# EAGLE design HenryBoard (EAGLE 7.2.0)

## Sheet 1 of 2: Supply
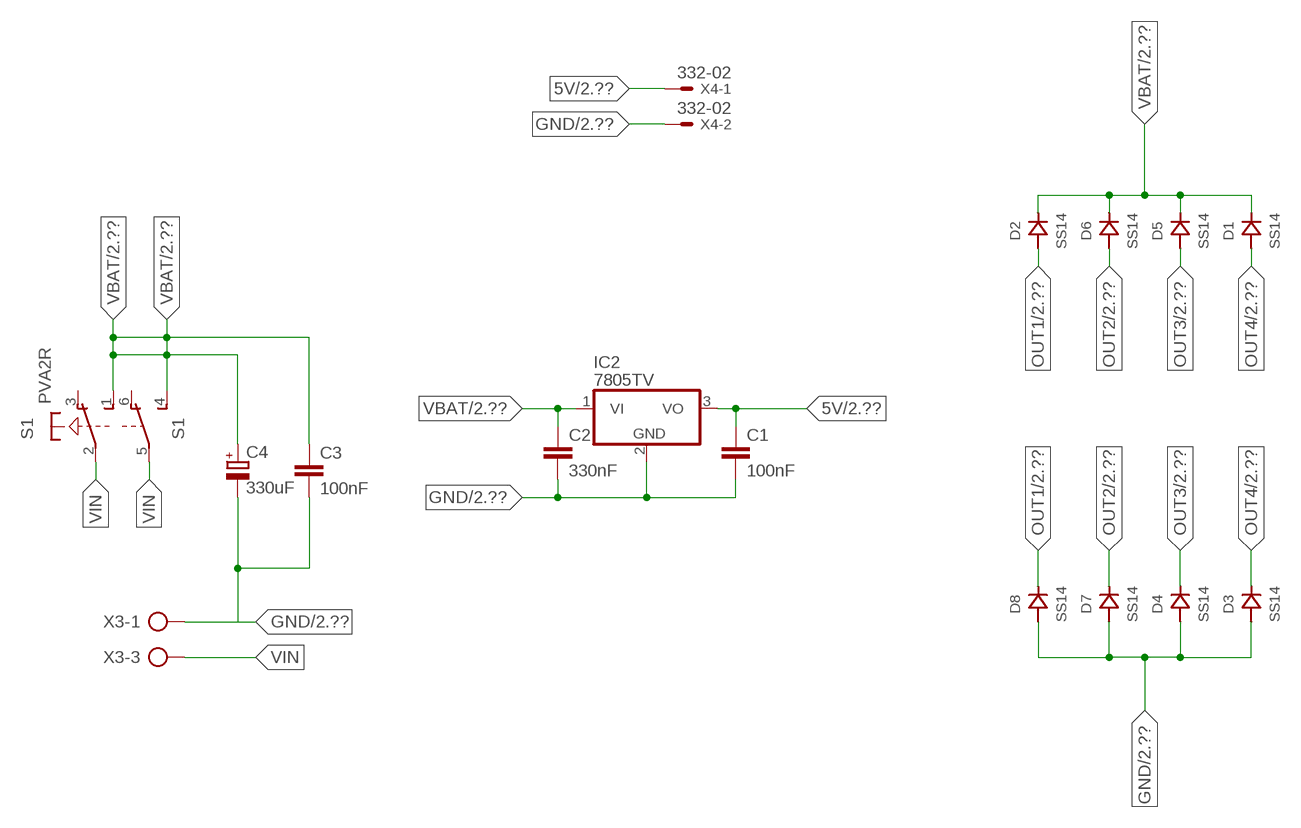
[diagram p0: schematic, sheet 1]

### Parts
C1  100nF  CAP0805  [0805]
C2  330nF  C-EU025-030X050  [C025-030X050]
C3  100nF  CAP0805  [0805]
C4  330uF  CPOL-EUE5-13  [E5-13]
D1  SS14  [DO214]
D2  SS14  [DO214]
D3  SS14  [DO214]
D4  SS14  [DO214]
D5  SS14  [DO214]
D6  SS14  [DO214]
D7  SS14  [DO214]
D8  SS14  [DO214]
IC2  7805TV  [TO220V]
S1  PVA2R  [PVA2R]
X3  AK300/3  [AK300/3]
X4  332-02  [332-02]

### Nets
5V: C1.1 IC2.3(VO) ; also sheet 2
GND: C1.2 C2.2 C3.2 C4.- D3.ANODE D4.ANODE D7.ANODE D8.ANODE IC2.2(GND) X3.1 ; also sheet 2
OUT1: D2.ANODE D8.CATHODE ; also sheet 2
OUT2: D6.ANODE D7.CATHODE ; also sheet 2
OUT3: D4.CATHODE D5.ANODE ; also sheet 2
OUT4: D1.ANODE D3.CATHODE ; also sheet 2
VBAT: C2.1 C3.1 C4.+ D1.CATHODE D2.CATHODE D5.CATHODE D6.CATHODE IC2.1(VI) S1.1(1:S) S1.4(2:S) ; also sheet 2
VIN: S1.2(1:P) S1.5(2:P) X3.3
Unconnected: S1.3(1:O) S1.6(2:O) X3.2 X4.1 X4.2

## Sheet 2 of 2: H Bridge
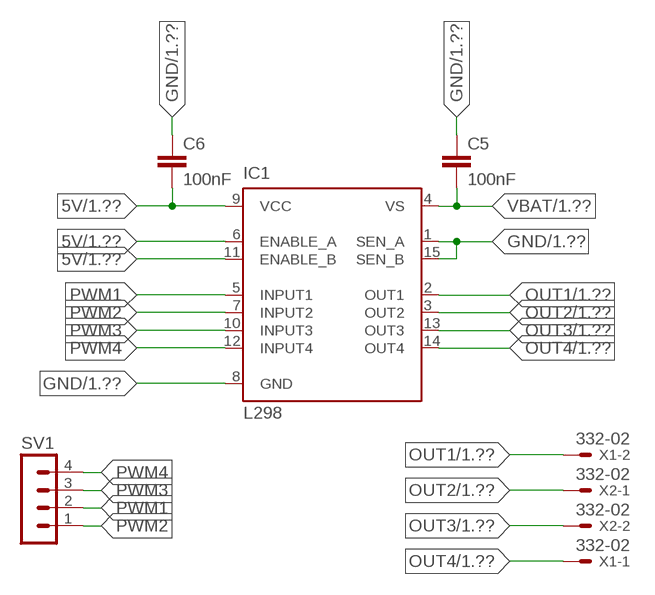
[diagram p1: schematic, sheet 2]

### Parts
C5  100nF  CAP0805  [0805]
C6  100nF  CAP0805  [0805]
IC1  L298  [MULTIWATT-15]
SV1  MA04-1  [MA04-1]
X1  332-02  [332-02]
X2  332-02  [332-02]

### Nets
5V: C6.2 IC1.6(ENABLE_A) IC1.9(VCC) IC1.11(ENABLE_B) ; also sheet 1
GND: C5.1 C6.1 IC1.1(SEN_A) IC1.8(GND) IC1.15(SEN_B) ; also sheet 1
OUT1: IC1.2(OUT1) X1.2 ; also sheet 1
OUT2: IC1.3(OUT2) X2.1 ; also sheet 1
OUT3: IC1.13(OUT3) X2.2 ; also sheet 1
OUT4: IC1.14(OUT4) X1.1 ; also sheet 1
PWM1: IC1.5(INPUT1) SV1.2
PWM2: IC1.7(INPUT2) SV1.1
PWM3: IC1.10(INPUT3) SV1.3
PWM4: IC1.12(INPUT4) SV1.4
VBAT: C5.2 IC1.4(VS) ; also sheet 1

## Library data of the parts
C1 C3 C5 C6 = SparkFun-Capacitors:CAP: Capacitor Standard 0603 ceramic capacitor, and 0.1" leaded capacitor.
C2 = rcl:C-EU: CAPACITOR, European symbol
C4 = rcl:CPOL-EU: POLARIZED CAPACITOR, European symbol
D1-D8 = ihpcb-diode:SS14
IC1 = st-microelectronics:L298: DUAL FULL-BRIDGE DRIVER; MPN: L298N; OC_FARNELL: 1589425; OC_NEWARK: 32M1527
IC2 = linear:78*: Positive VOLTAGE REGULATOR Source: http://cache.national.com/ds/LM/LM78L05.pdf http://www.fairchildsemi.com/ds/LM/LM7805.pdf
S1 = switch-misc:PVA2R: ITT SWITCH
SV1 = con-lstb:MA04-1: PIN HEADER; OC_FARNELL: unknown; OC_NEWARK: unknown
X1 X2 X4 = con-garry:332-02: 2 Pin - 2mm Dual Row Source: www.mpe-connector.de / garry_shortform_2012.pdf
X3 = con-ptr500:AK300/3: CONNECTOR; OC_FARNELL: unknown; OC_NEWARK: unknown

## Board
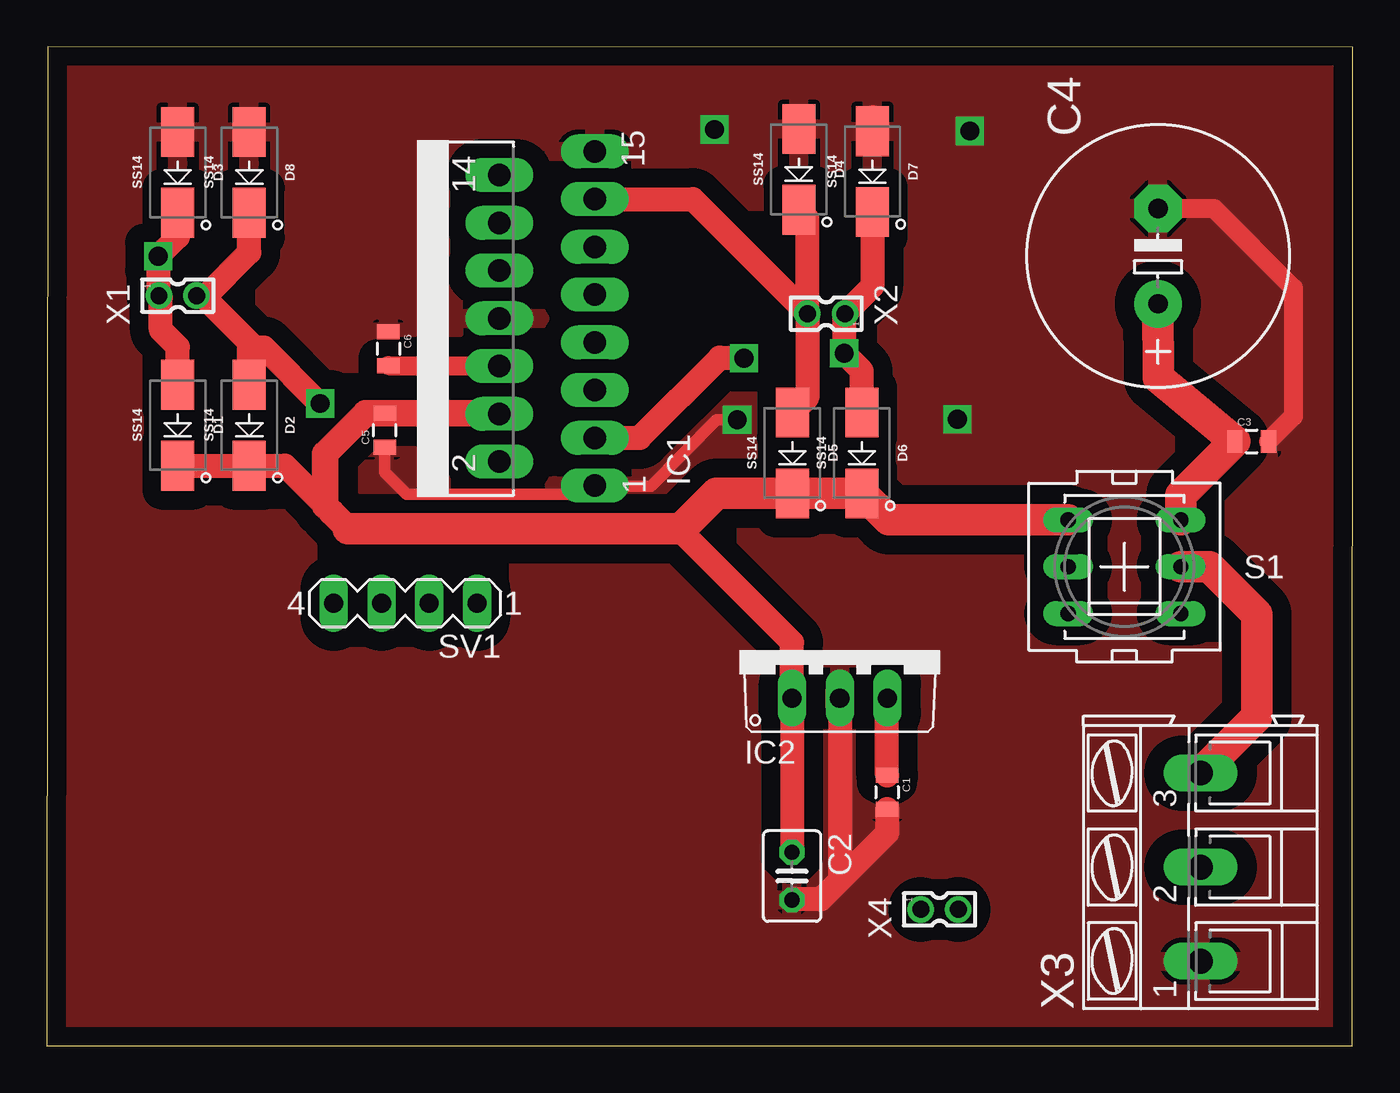
[diagram p2: board, top side]
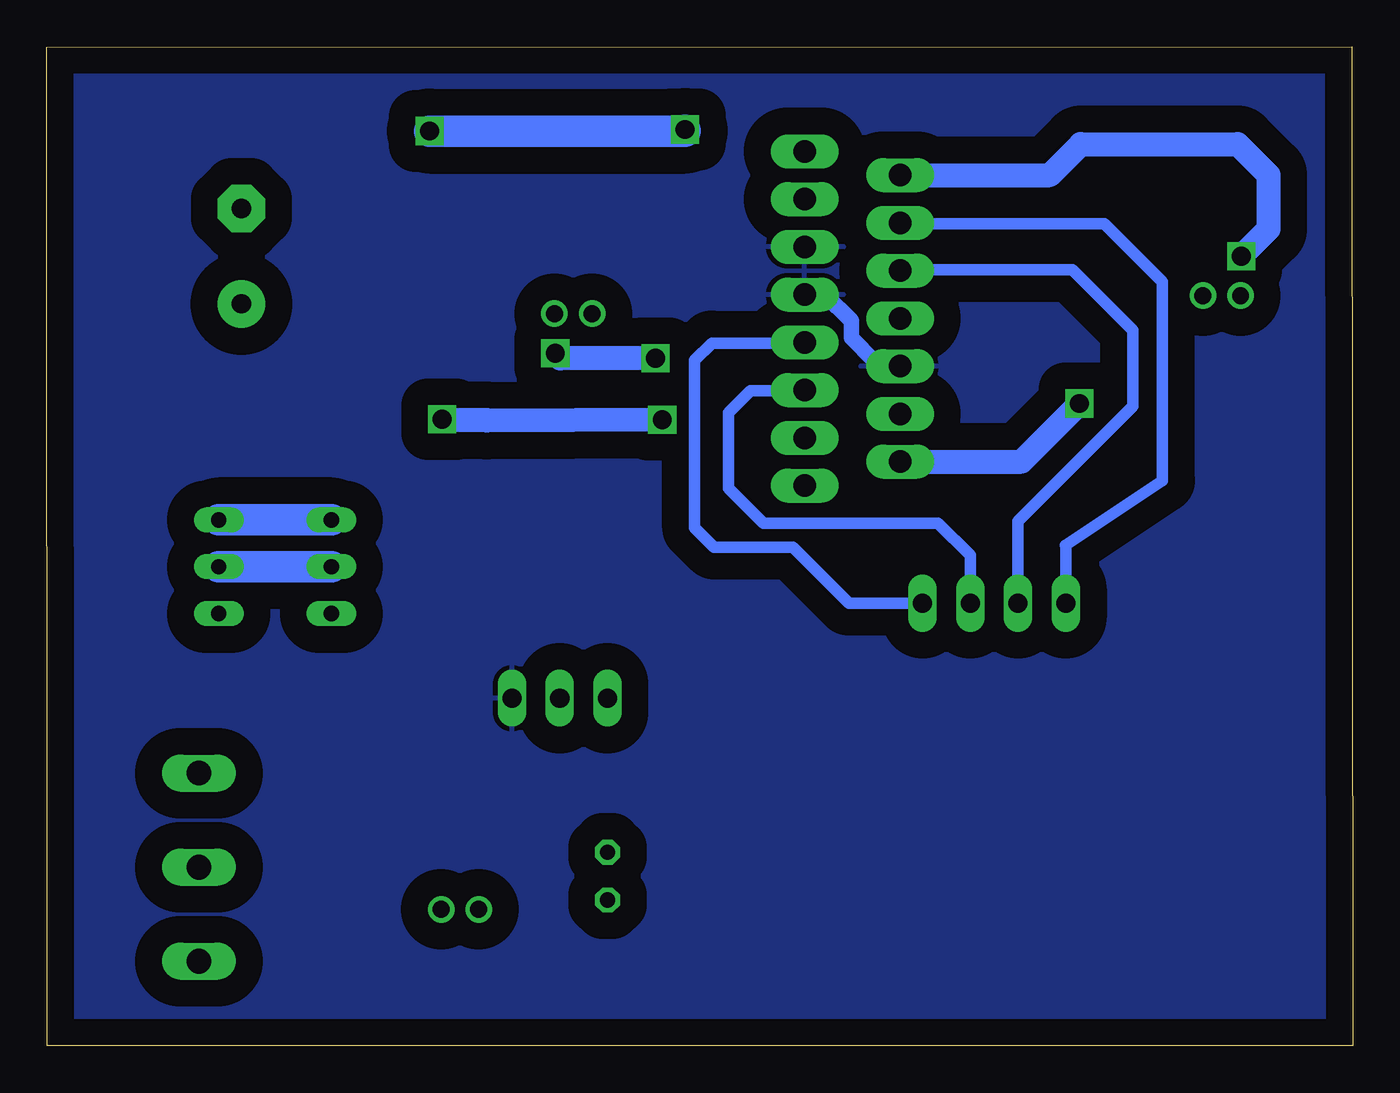
[diagram p3: board, bottom side, seen from below]

Size 69.48 x 53.13 mm. Coordinates in mm from the lower left corner, seen from the top.
Outline: 0,0 69.47,0 69.48,53.11 0.05,53.13 0,0
Copper layers (1*16): Top 0.035mm / dielectric 1.5mm / Bottom 0.035mm
Design rules "default": minimum track width 10mil, minimum drill 24mil, track to track 8mil, track to pad 8mil, pad to pad 8mil, via to via 8mil, smd to smd 8mil, copper to edge 40mil, drill to drill 8mil, minimum pad ring 10mil, minimum via ring 8mil, stop-mask expansion 4mil, vias tented up to drill 0mil, thermal gap 10mil

### Footprints (pad centres in the part's own frame; a part is rotated, then mirrored left to right if it is on the bottom)
0805 = smd 0.8 x 1.2: 1 -0.9,0; 2 0.9,0
C025-030X050 = drill 0.813 octagon: 1 -1.27,0; 2 1.27,0
E5-13 = drill 1.016 pad 2.54: + -2.54,0 | drill 1.016 pad 2.54 octagon: - 2.54,0
DO214 = smd 2.65 x 1.75: ANODE -2.15,0; CATHODE 2.15,0
MULTIWATT-15 = drill 1.2 long: 1 -8.89,-7.62; 2 -7.62,-2.54; 3 -6.35,-7.62; 4 -5.08,-2.54; 5 -3.81,-7.62; 6 -2.54,-2.54; 7 -1.27,-7.62; 8 0,-2.54; 9 1.27,-7.62; 10 2.54,-2.54; 11 3.81,-7.62; 12 5.08,-2.54; 13 6.35,-7.62; 14 7.62,-2.54; 15 8.89,-7.62
TO220V = drill 1.016 long: 1 -2.54,-2.54; 2 0,-2.54; 3 2.54,-2.54
PVA2R = drill 0.813 long: 1 -2.997,2.489; 2 -2.997,0; 3 -2.997,-2.489; 4 2.997,2.489; 5 2.997,0; 6 2.997,-2.489
MA04-1 = drill 1.016 long: 1 -3.81,0; 2 -1.27,0; 3 1.27,0; 4 3.81,0
332-02 = drill 0.9 pad 1.27: 1 0,-1; 2 0,1
AK300/3 = drill 1.321 long: 1 -5.004,0; 2 0,0; 3 5.004,0

### Placement (x,y rotation side)
C1  44.71,13.48 270 top
C2  39.65,9.02 270 top
C3  64.11,32.15 0 top
C4  59.13,42 90 top
C5  17.98,32.74 90 top
C6  18.17,37.08 270 top
D1  6.96,33.01 270 top
D2  10.77,33.01 270 top
D3  6.96,46.46 270 top
D4  40.01,46.62 270 top
D5  39.67,31.53 270 top
D6  43.37,31.53 270 top
D7  43.93,46.5 270 top
D8  10.77,46.46 270 top
IC1  21.54,38.69 90 top
IC2  42.19,21.03 0 top
S1  57.34,25.48 0 top
SV1  19.07,23.54 180 top
X1  6.96,39.9 270 top
X2  41.47,38.94 90 top
X3  61.39,9.5 90 top
X4  47.5,7.25 270 top

### Tracks (layer width: path | path; a pad name or v marks a point on that pad's centre or on a via)
5V
  Top 1.016: C6.2 24.05,36.18 IC1.6
  Top 1.27: C1.1 44.71,18.47 IC2.3
  Bottom 0.813: IC1.9 28.08,39.96 26.68,38.56 26.68,37.66 25.44,36.42 25.39,36.42 25.09,36.12 24.11,36.12 IC1.6
  pour Bottom (isolate 1.422): -0.04,52.73 68.96,52.61 69.18,-0.15 0.18,-0.03
GND  (via drill 1)
  Top 0.61: v36.73,33.3 35.64,33.3 32.15,29.76 29.2,29.76 IC1.1 28.7,29.34 19.14,29.34 17.98,30.5 C5.1
  Top 1.016: 43.94,49.55 D7.ANODE | C4.- 62.1,44.54 66.34,40.3 66.34,33.48 C3.2
  Top 1.27: IC2.2 42.19,8.79 | 42.19,8.79 41.18,7.78 39.68,7.78 C2.2 | C1.2 44.71,11.31 42.19,8.79
  Bottom 1.27: v36.73,33.3 46.08,33.25 46.08,33.28 48.45,33.28 v48.45,33.32
  Bottom 1.676: v49.12,48.66 35.52,48.66 35.52,48.69
  other vias: 35.52,48.74
  pour Top (isolate 1.016): 0.76,53.46 68.96,53.73 68.64,0.77 0.57,0.98
OUT1  (via drill 1)
  Top 1.016: 10.79,44.29 D8.CATHODE
  Top 1.27: X1.2 8.46,39.9 | 8.46,39.9 10.77,42.21 D8.CATHODE | 8.46,39.9 8.46,39.72 10.73,37.45 | 10.73,37.45 10.73,35.2 D2.ANODE | v14.53,34.16 v14.52,34.16 11.55,37.13 11.05,37.13 10.73,37.45
  Top 1.422: 10.74,44.28 D8.CATHODE
  Bottom 1.27: IC1.2 17.62,31.07 v14.53,34.16
OUT2  (via drill 1)
  Top 1.27: D7.CATHODE 43.93,40.4 X2.1 42.43,38.9 v42.43,36.84 43.37,35.9 D6.ANODE | IC1.3 31.54,32.34 35.81,36.61 37.05,36.61 v37.09,36.57
  Bottom 1.27: v37.09,36.57 42.16,36.57 v42.43,36.84
OUT3
  Top 1.27: X2.2 40.47,34.48 D5.ANODE | X2.2 40.47,44.01 D4.CATHODE | IC1.13 34.37,45.04 X2.2
OUT4  (via drill 1)
  Top 1.016: 5.99,39.87 X1.1
  Top 1.27: D1.ANODE 6.96,37.18 6.06,38.08 6.06,39.8 X1.1 5.92,39.94 v5.92,41.99 6.96,43.03 D3.CATHODE
  Bottom 1.27: IC1.14 16.11,46.31 14.46,47.96 6.11,47.96 4.47,46.32 4.47,43.44 v5.92,41.99
PWM1
  Bottom 0.61: IC1.5 29.21,34.83 32.05,34.83 33.2,33.68 33.2,29.65 31.35,27.8 22.06,27.8 20.34,26.08 SV1.2
PWM2
  Bottom 0.61: IC1.7 29.2,37.38 34.1,37.38 35.01,36.47 35.01,27.55 33.98,26.52 29.79,26.52 26.81,23.54 SV1.1
PWM3
  Bottom 0.61: IC1.10 24.04,41.27 14.9,41.27 11.7,38.07 11.7,34.01 17.82,27.89 17.8,27.87 SV1.3
PWM4
  Bottom 0.61: IC1.12 24.03,43.72 13.2,43.72 10.12,40.64 10.12,30.06 15.28,26.62 15.26,26.6 SV1.4
VBAT
  Top 1.016: 24.05,33.64 IC1.4
  Top 1.27: D1.CATHODE D2.CATHODE 12.67,30.86 14.8,28.73 15.14,28.39 | 33.6,27.5 39.65,21.45 IC2.1 C2.1 | D6.CATHODE
  Top 1.422: 24.05,33.64 C5.2 16.96,33.64 14.8,31.48 14.8,28.73 | 15.14,28.39 16.03,27.5
  Top 1.676: C4.+ 59.14,35.53 C3.1 60.34,29.28 S1.4 | D6.CATHODE D5.CATHODE 35.62,29.38 33.74,27.5 33.6,27.5 16.03,27.5 | D6.CATHODE 44.8,27.97 S1.1
  Bottom 1.676: S1.1 S1.4
VIN
  Top 1.676: S1.5 61.87,25.48 64.39,22.96 64.39,17.5 X3.3
  Bottom 1.676: S1.2 S1.5